# Altium project Inverter.PrjPcb
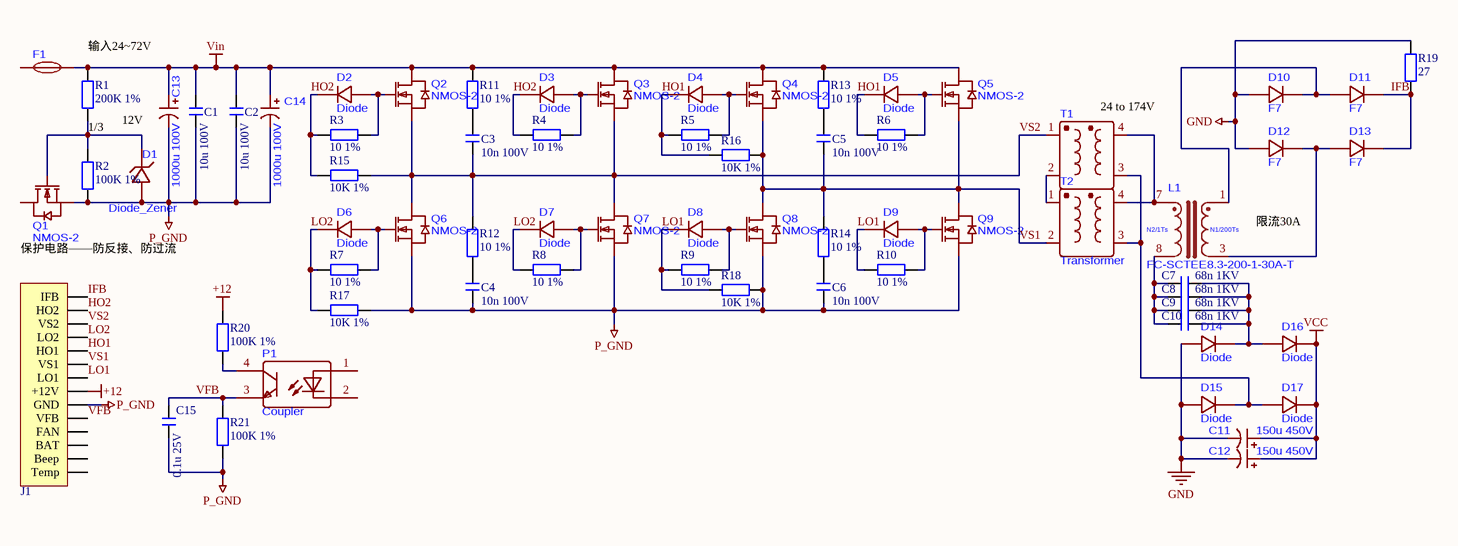
[diagram p0: Sheet1.SchDoc]
1 sheet, 68 parts. Net scope: global (net labels, ports and power ports of the same name join across sheets).

## Sheet Sheet1.SchDoc
size A4; SheetNumber: 1; SheetTotal: 1

### Parts
C1  10u 100V  [C2220]
C2  10u 100V  [C2220]
C3  10n 100V  [C2220]
C4  10n 100V  [C2220]
C5  10n 100V  [C2220]
C6  10n 100V  [C2220]
C7  68n 1KV  [CAP-TH_L18.0-W8.5-P15.00-D0.8]
C8  68n 1KV  [CAP-TH_L18.0-W8.5-P15.00-D0.8]
C9  68n 1KV  [CAP-TH_L18.0-W8.5-P15.00-D0.8]
C10  68n 1KV  [CAP-TH_L18.0-W8.5-P15.00-D0.8]
C11  150u 450V  [CAP-TH_BD22.0-P10.00-D2.3-FD]
C12  150u 450V  [CAP-TH_BD22.0-P10.00-D2.3-FD]
C13  1000u 100V  [CAP-TH_BD18.0-P7.50-D0.8-FD]
C14  1000u 100V  [CAP-TH_BD22.0-P10.00-D2.3-FD]
C15  0.1u 25V  [C0805]
D1  Diode_Zener  [SOD-123_L2.7-W1.6-LS3.7-RD-1]
D2  Diode  [SOD-123_L2.7-W1.6-LS3.7-RD-1]
D3  Diode  [SOD-123_L2.7-W1.6-LS3.7-RD-1]
D4  Diode  [SOD-123_L2.7-W1.6-LS3.7-RD-1]
D5  Diode  [SOD-123_L2.7-W1.6-LS3.7-RD-1]
D6  Diode  [SOD-123_L2.7-W1.6-LS3.7-RD-1]
D7  Diode  [SOD-123_L2.7-W1.6-LS3.7-RD-1]
D8  Diode  [SOD-123_L2.7-W1.6-LS3.7-RD-1]
D9  Diode  [SOD-123_L2.7-W1.6-LS3.7-RD-1]
D10  F7  [DO-214AC_L4.3-W2.7-LS5.2-RD]
D11  F7  [DO-214AC_L4.3-W2.7-LS5.2-RD]
D12  F7  [DO-214AC_L4.3-W2.7-LS5.2-RD]
D13  F7  [DO-214AC_L4.3-W2.7-LS5.2-RD]
D14  Diode  [DO-214AC_L4.3-W2.7-LS5.2-RD]
D15  Diode  [DO-214AC_L4.3-W2.7-LS5.2-RD]
D16  Diode  [DO-214AC_L4.3-W2.7-LS5.2-RD]
D17  Diode  [DO-214AC_L4.3-W2.7-LS5.2-RD]
F1  Fuse-S1032-F-50.0A  [FUSE-SMD_L10.3-W3.2]  (value not drawn)
J1  HDR-1X14  [HDR2.54-Y-LI-14P]  (value not drawn)
L1  FC-SCTEE8.3-200-1-30A-T  [XFMR-SMD_FC-SCTEE8.3-200-1-30A-T]
P1  Coupler  [SOP-4_L6.5-W4.6-P2.54-LS10.2-TL]
Q1  NMOS-2  [TO-263-2_L10.2-W8.9-P5.08-LS15.0-BR-1]
Q2  NMOS-2  [TO-247AC-3_L15.8-W5.0-P5.46-L]
Q3  NMOS-2  [TO-247AC-3_L15.8-W5.0-P5.46-L]
Q4  NMOS-2  [TO-247AC-3_L15.8-W5.0-P5.46-L]
Q5  NMOS-2  [TO-247AC-3_L15.8-W5.0-P5.46-L]
Q6  NMOS-2  [TO-247AC-3_L15.8-W5.0-P5.46-L]
Q7  NMOS-2  [TO-247AC-3_L15.8-W5.0-P5.46-L]
Q8  NMOS-2  [TO-247AC-3_L15.8-W5.0-P5.46-L]
Q9  NMOS-2  [TO-247AC-3_L15.8-W5.0-P5.46-L]
R1  200K 1%  [R1206]
R2  100K 1%  [R1206]
R3  10 1%  [R1206]
R4  10 1%  [R1206]
R5  10 1%  [R1206]
R6  10 1%  [R1206]
R7  10 1%  [R1206]
R8  10 1%  [R1206]
R9  10 1%  [R1206]
R10  10 1%  [R1206]
R11  10 1%  [R1206]
R12  10 1%  [R1206]
R13  10 1%  [R1206]
R14  10 1%  [R1206]
R15  10K 1%  [R1206]
R16  10K 1%  [R1206]
R17  10K 1%  [R1206]
R18  10K 1%  [R1206]
R19  27  [R1206]
R20  100K 1%  [R1206]
R21  100K 1%  [R1206]
T1  Transformer  [TAN-PQ5035(4+6) -4]  (value not drawn)
T2  Transformer  [TAN-PQ5035(4+6) -4]

### Nets
+12: J1.7(+12V) R20.2
GND: C11.2 C12.2 D10.2(+) D12.2(+) D14.2(+) D15.2(+) R19.1
P_GND: C1.2 C2.2 C4.2 C6.2 C13.2 C14.2 C15.1 D1.2(A) J1.6(GND) Q1.2(S) Q6.2(S) Q7.2(S) Q8.2(S) Q9.2(S) R2.1 R17.2 R18.2 R21.1
VCC: C11.1 C12.1 D16.1(-) D17.1(-)
Vin: C1.1 C2.1 C13.1 C14.1 F1.2 Q2.3(D) Q3.3(D) Q4.3(D) Q5.3(D) R1.2 R11.2 R13.1
HO1: D4.1(-) D5.1(-) J1.10(HO1) R5.1 R6.1 R16.1
HO2: D2.1(-) D3.1(-) J1.13(HO2) R3.1 R4.1 R15.1
IFB: D11.1(-) D13.1(-) J1.14(IFB) R19.2
LO1: D8.1(-) D9.1(-) J1.8(LO1) R9.1 R10.1 R18.1
LO2: D6.1(-) D7.1(-) J1.11(LO2) R7.1 R8.1 R17.1
VFB: C15.2 J1.5(VFB) P1.3 R21.2
VS1: C5.2 J1.9(VS1) Q4.2(S) Q5.2(S) Q8.3(D) Q9.3(D) R14.1 R16.2 T2.2
VS2: C3.1 J1.12(VS2) Q2.2(S) Q3.2(S) Q6.3(D) Q7.3(D) R12.1 R15.2 T1.1
NetC3_2: C3.2 R11.1
NetC4_1: C4.1 R12.2
NetC5_1: C5.1 R13.2
NetC6_1: C6.1 R14.2
NetC7_1: C7.1 C8.1 C9.1 C10.1 L1.8
NetC7_2: C7.2 C8.2 C9.2 C10.2 D14.1(-) D16.2(+)
NetD1_1: D1.1(K) Q1.1(G) R1.1 R2.2
NetD2_2: D2.2(+) Q2.1(G) R3.2
NetD3_2: D3.2(+) Q3.1(G) R4.2
NetD4_2: D4.2(+) Q4.1(G) R5.2
NetD5_2: D5.2(+) Q5.1(G) R6.2
NetD6_2: D6.2(+) Q6.1(G) R7.2
NetD7_2: D7.2(+) Q7.1(G) R8.2
NetD8_2: D8.2(+) Q8.1(G) R9.2
NetD9_2: D9.2(+) Q9.1(G) R10.2
NetD10_1: D10.1(-) D11.2(+) L1.1
NetD12_1: D12.1(-) D13.2(+) L1.3
NetD15_1: D15.1(-) D17.2(+) T1.3 T2.3
NetL1_7: L1.7 T1.4 T2.4
NetP1_4: P1.4 R20.1
NetT1_2: T1.2 T2.1

Not connected (* = marked no-connect by the designer): F1 1; J1 1(Temp) 2(Beep) 3(BAT) 4(FAN); P1 1 2; Q1 3(D)

### Notes on the sheet
- 输入24~72V
- (near R1) 1/3
- 12V
- (near T1) 24 to 174V
- (near L1) 限流30A
- 保护电路——防反接、防过流
- (in symbol FC-SCTEE8.3-200-1-30A-T) N2/1Ts; N1/200Ts

### Library data of the parts
C1-C6 = CAP: 贴片电容; Part_number: *; Brand: *
C7-C10 = CAP: 贴片电容/安规电容; Part_number: MMK683J3ADSAJ208G0; Brand: KNSCHA(科尼盛)
C11 C12 = CAP_1: 固态电容/电解电容; Part_number: KN151M45022*35A; Brand: KFSON(康富松)
C13 C14 = CAP_1: 固态电容/电解电容; Part_number: KF102M10018*36A; Brand: KFSON(康富松)
C15 = CAP: 贴片电容/安规电容; Part_number: CC0805MRX7R8BB104; Brand: YAGEO(国巨)
D1 = Diode_Zener: 稳压二极管（齐纳二极管），12V,500mW; Part_number: BZT52C12; Brand: GOODWORK(固得沃克)
D2-D9 = Diode: Diode,1N4148W,开关二极管,CJ(江苏长电/长晶); Part_number: 1N4148W; Brand: CJ(江苏长电/长晶)
D10-D13 = Diode: Diode，快恢复/超快恢复二极管，1KV，1A; Brand: GOODWORK(固得沃克); Part_number: F7
D14-D17 = Diode: Part_number: GC6D10065A; Brand: SUPSiC(国晶微半导体)
F1 = Fuse-S1032-F-50.0A: 一次性保险丝，额定50A，分断180A; Brand: SART(萨特); Part_number: S1032-F-50.0A
J1 = EGT003: Header, 14-Pin; Brand: *; Part_number: *
L1 = FC-SCTEE8.3-200-1-30A-T: 交流互感器,30A,1:200; Part_number: *; Brand: *
P1 = Coupler: 光耦,1.2V,5KV; Part_number: PC817C; Brand: Slkor(萨科微)
Q1 = NMOS-2: NMOS，100V150A; Part_number: SWB075R08E7T; Brand: Samwin(芯派)
Q2-Q9 = NMOS-2: NMOS，150V，171A; Part_number: IRFP4568PBF; Brand: Infineon(英飞凌)
R1 = RES: 贴片电阻; Part_number: AC1206FR-07200KL; Brand: YAGEO(国巨)
R2 = RES: 贴片电阻; Part_number: RC1206FR-07100KL; Brand: YAGEO(国巨)
R3-R14 = RES: 贴片电阻; Part_number: RC1206FR-0710RL; Brand: YAGEO(国巨)
R15-R18 = RES: 贴片电阻; Part_number: RC1206FR-0710KL; Brand: YAGEO(国巨)
R19 = RES: 贴片电阻; Part_number: RC1206FR-0727RL; Brand: YAGEO(国巨)
R20 R21 = RES: 贴片电阻; Part_number: *
T1 T2 = Transformer: 变压器,2KW,29:4,屹晶微定制; Part_number: *; Brand: *